# Altium schematic sheet PSU_VCC1V5_Buck.SchDoc
size A3; SheetNumber: 7; SheetTotal: 32
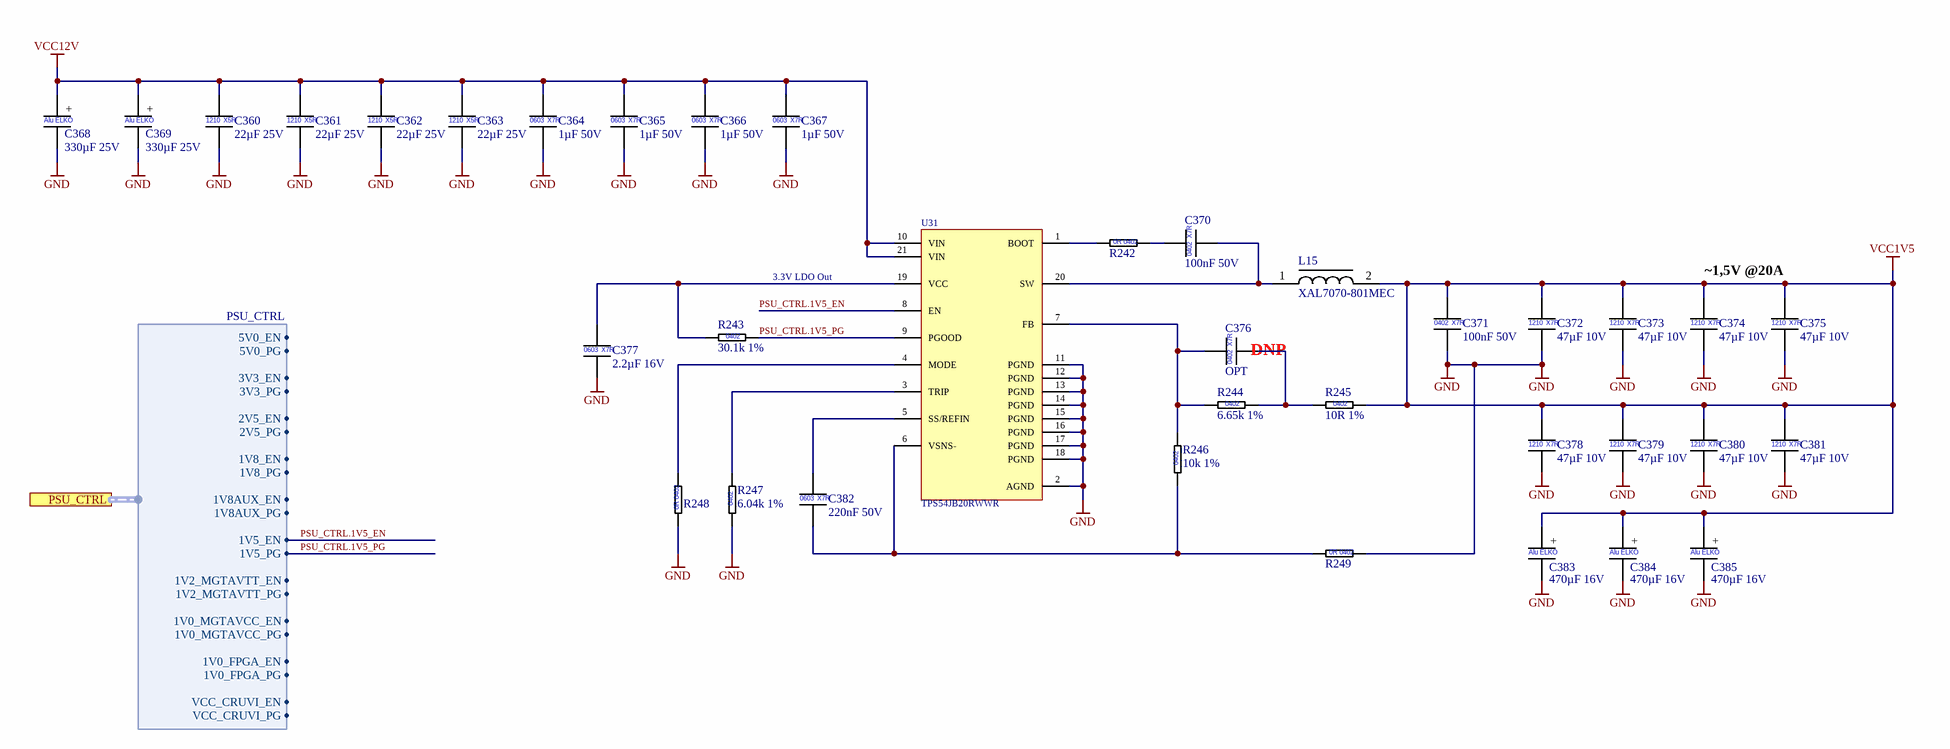
[diagram p0: PSU_VCC1V5_Buck.SchDoc]

## Parts
C360  22µF 25V  [CAP_1210]
C361  22µF 25V  [CAP_1210]
C362  22µF 25V  [CAP_1210]
C363  22µF 25V  [CAP_1210]
C364  1µF 50V  [CAP_0603]
C365  1µF 50V  [CAP_0603]
C366  1µF 50V  [CAP_0603]
C367  1µF 50V  [CAP_0603]
C368  330µF 25V  [WCAP-PTG5_D10H12.5]
C369  330µF 25V  [WCAP-PTG5_D10H12.5]
C370  100nF 50V  [CAP_0402]
C371  100nF 50V  [CAP_0402]
C372  47µF 10V  [CAP_1210]
C373  47µF 10V  [CAP_1210]
C374  47µF 10V  [CAP_1210]
C375  47µF 10V  [CAP_1210]
C376  OPT  [CAP_0402]  (no BOM)
C377  2.2µF 16V  [CAP_0603]
C378  47µF 10V  [CAP_1210]
C379  47µF 10V  [CAP_1210]
C380  47µF 10V  [CAP_1210]
C381  47µF 10V  [CAP_1210]
C382  220nF 50V  [CAP_0603]
C383  470µF 16V  [WCAP-PTG5_D8H13]
C384  470µF 16V  [WCAP-PTG5_D8H13]
C385  470µF 16V  [WCAP-PTG5_D8H13]
L15  XAL7070-801MEC  [COILCRAFT_XAL7070]
R242  0R Jumper  [RES_0402]  (value not drawn)
R243  30.1k 1%  [RES_0402]
R244  6.65k 1%  [RES_0402]
R245  10R 1%  [RES_0402]
R246  10k 1%  [RES_0402]
R247  6.04k 1%  [RES_0402]
R248  0R Jumper  [RES_0402]  (value not drawn)
R249  0R Jumper  [RES_0402]  (value not drawn)
U31  TPS54JB20RWWR  [VQFN-HR21_RWW0021A]

## Ports
PSU_CTRL (harness PSU_CTRL, see Power-Tree[2C], PSU_MGTAVCC_Buck[1B], PSU_MGTAVTT_Buck[1B], PSU_VCC1V0_FPGA_Buck[1B], PSU_VCC1V8_Buck[1B], PSU_VCC1V8AUX_Buck[1B], PSU_VCC2V5_Buck[1B], PSU_VCC3V3_Buck[1B], PSU_VCC5V_Buck[1B], PSU_VCC_CRUVI_ADJ_Buck[1B])

## Harnesses
PSU_CTRL: 5V0_EN, 5V0_PG, 3V3_EN, 3V3_PG, 2V5_EN, 2V5_PG, 1V8_EN, 1V8_PG, 1V8AUX_EN, 1V8AUX_PG, 1V5_EN, 1V5_PG, 1V2_MGTAVTT_EN, 1V2_MGTAVTT_PG, 1V0_MGTAVCC_EN, 1V0_MGTAVCC_PG, 1V0_FPGA_EN, 1V0_FPGA_PG, VCC_CRUVI_EN, VCC_CRUVI_PG

## Nets
GND: C360.2 C361.2 C362.2 C363.2 C364.2 C365.2 C366.2 C367.2 C368.2 C369.2 C371.2 C372.2 C373.2 C374.2 C375.2 C377.2 C378.2 C379.2 C380.2 C381.2 C383.2 C384.2 C385.2 R247.1 R248.1 R249.2 U31.2(AGND) U31.11(PGND) U31.12(PGND) U31.13(PGND) U31.14(PGND) U31.15(PGND) U31.16(PGND) U31.17(PGND) U31.18(PGND)
VCC1V5: C371.1 C372.1 C373.1 C374.1 C375.1 C378.1 C379.1 C380.1 C381.1 C383.1 C384.1 C385.1 L15.2 R245.2
VCC12V: C360.1 C361.1 C362.1 C363.1 C364.1 C365.1 C366.1 C367.1 C368.1 C369.1 U31.10(VIN) U31.21(VIN)
PSU_CTRL.1V5_EN: U31.8(EN) ; port PSU_CTRL.1V5_EN
PSU_CTRL.1V5_PG: R243.2 U31.9(PGOOD) ; port PSU_CTRL.1V5_PG
NetC370_1: C370.1 R242.2
NetC370_2: C370.2 L15.1 U31.20(SW)
NetC376_1: C376.1 R244.1 R246.2 U31.7(FB)
NetC376_2: C376.2 R244.2 R245.1
NetC377_1: C377.1 R243.1 U31.19(VCC)
NetC382_1: C382.1 U31.5(SS/REFIN)
NetC382_2: C382.2 R246.1 R249.1 U31.6(VSNS-)
NetR242_1: R242.1 U31.1(BOOT)
NetR247_2: R247.2 U31.3(TRIP)
NetR248_2: R248.2 U31.4(MODE)

## Notes on the sheet
- 3.3V LDO Out
- (near C375) ~1,5V @20A
- (near C376) DNP
- Company:
- Contact:
- Customer:
- mail@pcb-arts.com
- PCB Arts GmbH
- Title:
- Project:
- The  information  contained  in  these  documents  is  confidential,  privileged  and  only  for  the information of the intended recipient and may not be used, published or redistributed Without the prior written consent from PCB Arts GmbH.
- Engineer:
- Document Number:
- Revision:
- Variant:
- Date:
- Time:
- Sheet:
- Status:
- /
- (in symbol CAP_0402_100nF_50V) X7R; 0402
- (in symbol CAP_0402_OPT) X7R; 0402
- (in symbol CAP_0603_1µF_50V_X7R_10%) 0603; X7R
- (in symbol CAP_0603_2.2µF_16V_X7R_10%) 0603; X7R
- (in symbol CAP_0603_220nF_50V_X7R_10%) 0603; X7R
- (in symbol CAP_1210_22µF_25V) 1210; X5R
- (in symbol CAP_1210_47µF_10V_X7R_10%) 1210; X7R
- (in symbol CAP_D8L9_470µF_16V) +; Alu ELKO
- (in symbol CAP_D10L12.5_330µF_25V) +; Alu ELKO
- (in symbol RES_0402_0R Jumper) 0R 0402
- (in symbol RES_0402_6.04k_1%) 0402
- (in symbol RES_0402_6.65k_1%) 0402
- (in symbol RES_0402_10k_1%) 0402
- (in symbol RES_0402_10R_1%) 0402
- (in symbol RES_0402_30.1k_1%) 0402

## Library data of the parts
C360-C363 = CAP_1210_22µF_25V: Multilayer Ceramic Capacitors MLCC - SMD/SMT 1210 25VDC; Manufacturer 1: KEMET; Manufacturer 1 Prt. Nr.: C1210C226K3PACTU; Manufacturer 2 Prt. Nr.: TMK212BBJ226MG-TT; Manufacturer 2: Taiyo Yuden
C364-C367 = CAP_0603_1µF_50V_X7R_10%: Multilayer Ceramic Capacitors MLCC - SMD/SMT 50V 1uF X7R 0603 10%; Manufacturer 1: KYOCERA AVX; Manufacturer 1 Prt. Nr.: 06035C105KAT2A; Manufacturer 2 Prt. Nr.: MSASU168AB7105KTNA01; Manufacturer 2: TAIYO YUDEN
C368 C369 = CAP_D10L12.5_330µF_25V: Organische Polymer-Aluminiumkondensatoren 330uF 25 Volts 20% AEC-Q200; Manufacturer 1: Würth Elektronik; Manufacturer 1 Prt. Nr.: 870025575009
C370 C371 = CAP_0402_100nF_50V: Multilayer Ceramic Capacitors MLCC - SMD/SMT 0402 50VDC; Manufacturer 1: Murata Electronics; Manufacturer 1 Prt. Nr.: GCM155L8EH104KE07D; Manufacturer 2 Prt. Nr.: UMK105B7104KV-FR; Manufacturer 2: TDK
C372-C375 C378-C381 = CAP_1210_47µF_10V_X7R_10%: Multilayer Ceramic Capacitors MLCC - SMD/SMT 47 uF 10 VDC 10% 1210 X7R; Manufacturer 1: Murata Electronics; Manufacturer 1 Prt. Nr.: GRM32ER71A476KE15L; Manufacturer 2 Prt. Nr.: C1210C106K8RACTU; Manufacturer 2: KEMET
C376 = CAP_0402_OPT: Multilayer Ceramic Capacitors MLCC - SMD/SMT 0402 Optional Placeholder
C377 = CAP_0603_2.2µF_16V_X7R_10%: Multilayer Ceramic Capacitors MLCC - SMD/SMT 2.2 uF 16 VDC 10% 0603 X7R; Manufacturer 1: Murata Electronics; Manufacturer 1 Prt. Nr.: GRM188Z71C225KE43D; Manufacturer 2 Prt. Nr.: EMK107BB7225KA-T; Manufacturer 2: TAIYO YUDEN
C382 = CAP_0603_220nF_50V_X7R_10%: Multilayer Ceramic Capacitors MLCC - SMD/SMT 0.22 uF 50 VDC 10% 0603 X7R; Manufacturer 1: Murata Electronics; Manufacturer 1 Prt. Nr.: GRJ188R71H224KE11D; Manufacturer 2 Prt. Nr.: CGA3E3X7R1H224K080AE; Manufacturer 2: TDK
C383-C385 = CAP_D8L9_470µF_16V: Organische Polymer-Aluminiumkondensatoren 470uF 16 Volts 20%; Manufacturer 1: Würth Elektronik; Manufacturer 1 Prt. Nr.: 870025374007
L15 = XAL7070-801MEC_Power Inductors SMD 800nH Shld 20% 25.8A 2.29mOhms AECQ200: Power Inductors - SMD 800nH Shld 20% 25.8A 2.29mOhms AECQ200; Manufacturer 1: Coilcraft; Manufacturer 1 Prt. Nr.: XAL7070-801MEC
R242 R248 R249 = RES_0402_0R Jumper: Thick Film Resistors - SMD 0Ohm; Manufacturer 1: Vishay / Dale; Manufacturer 1 Prt. Nr.: CRCW04020000Z0EDC; Manufacturer 2 Prt. Nr.: RC0402JR-070RL; Manufacturer 2: Yageo
R243 = RES_0402_30.1k_1%: Thick Film Resistors - SMD 30.1kOhm 1%; Manufacturer 1: Vishay / Dale; Manufacturer 1 Prt. Nr.: CRCW040230K1FKEDC; Manufacturer 2 Prt. Nr.: RC0402FR-1330K1L; Manufacturer 2: Yageo
R244 = RES_0402_6.65k_1%: Thick Film Resistors - SMD 6.65kOhm 1%; Manufacturer 1: Vishay / Dale; Manufacturer 1 Prt. Nr.: CRCW04026K65FKEDC; Manufacturer 2 Prt. Nr.: RC0402FR-136K65L; Manufacturer 2: Yageo
R245 = RES_0402_10R_1%: Thick Film Resistors - SMD 10Ohm 1%; Manufacturer 1: Vishay / Dale; Manufacturer 1 Prt. Nr.: CRCW040210R0FKEE; Manufacturer 2 Prt. Nr.: RC0402FR-7W10RL; Manufacturer 2: Yageo
R246 = RES_0402_10k_1%: Thick Film Resistors - SMD 10kOhm 1%; Manufacturer 1: Vishay / Dale; Manufacturer 1 Prt. Nr.: CRCW040210K0FKEDC; Manufacturer 2 Prt. Nr.: RC0402FR-7W10KL; Manufacturer 2: Yageo
R247 = RES_0402_6.04k_1%: Thick Film Resistors - SMD 6.04kOhm 1%; Manufacturer 1: Vishay / Dale; Manufacturer 1 Prt. Nr.: CRCW04026K04FKEDC; Manufacturer 2 Prt. Nr.: RC0402FR-7W6K04L; Manufacturer 2: Yageo
U31 = TPS54JB20RWWR_Switching Voltage Regulators 2.7-V to 16-V input 20-A synchronous Buck: Switching Voltage Regulators 2.7-V to 16-V input 20-A synchronous Buck; Manufacturer 1: Texas Instruments; Manufacturer 1 Prt. Nr.: TPS54JB20RWWR